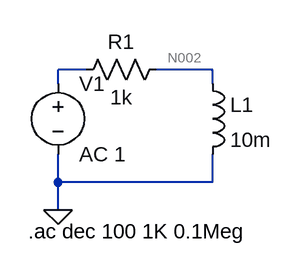
[diagram p0: schematic Circuit2.asc]
Circuit2.asc, the LTspice schematic file:
Version 4
SHEET 1 880 680
WIRE 80 112 48 112
WIRE 224 112 160 112
WIRE 48 128 48 112
WIRE 224 128 224 112
WIRE 48 240 48 208
WIRE 224 240 224 208
WIRE 224 240 48 240
WIRE 48 272 48 240
FLAG 48 272 0
SYMBOL ind 208 112 R0
SYMATTR InstName L1
SYMATTR Value 10m
SYMBOL res 176 96 R90
WINDOW 0 0 56 VBottom 2
WINDOW 3 32 56 VTop 2
SYMATTR InstName R1
SYMATTR Value 1k
SYMBOL voltage 48 112 R0
SYMATTR InstName V1
SYMATTR Value AC 1
TEXT 14 296 Left 2 !.ac dec 100 1K 0.1Meg

The netlist it stands for:
* Circuit2.asc
L1 N002 0 10m
R1 N002 N001 1k
V1 N001 0 AC 1
.ac dec 100 1K 0.1Meg
.backanno
.end

* Results of the author's LTspice run, read from the files saved beside the schematic
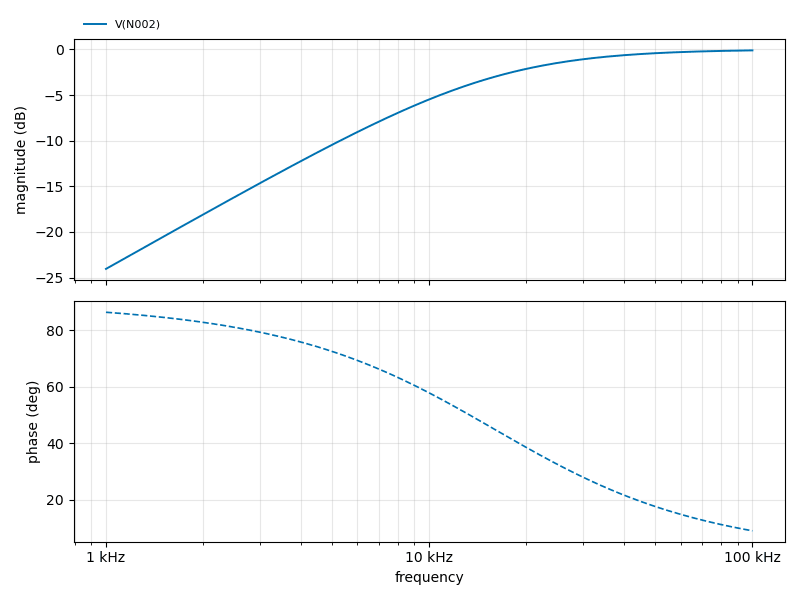
[diagram p1: AC Analysis of Circuit2.asc, plotted from the saved traces]
* AC Analysis, 1 run:
*   V(N002): -24.05 dB at 1 kHz, -0.11 dB at 100 kHz, peak -0.11 dB at 100 kHz, 3 dB below the peak at 15.53 kHz